# Altium project PCB_Project1.PrjPCB
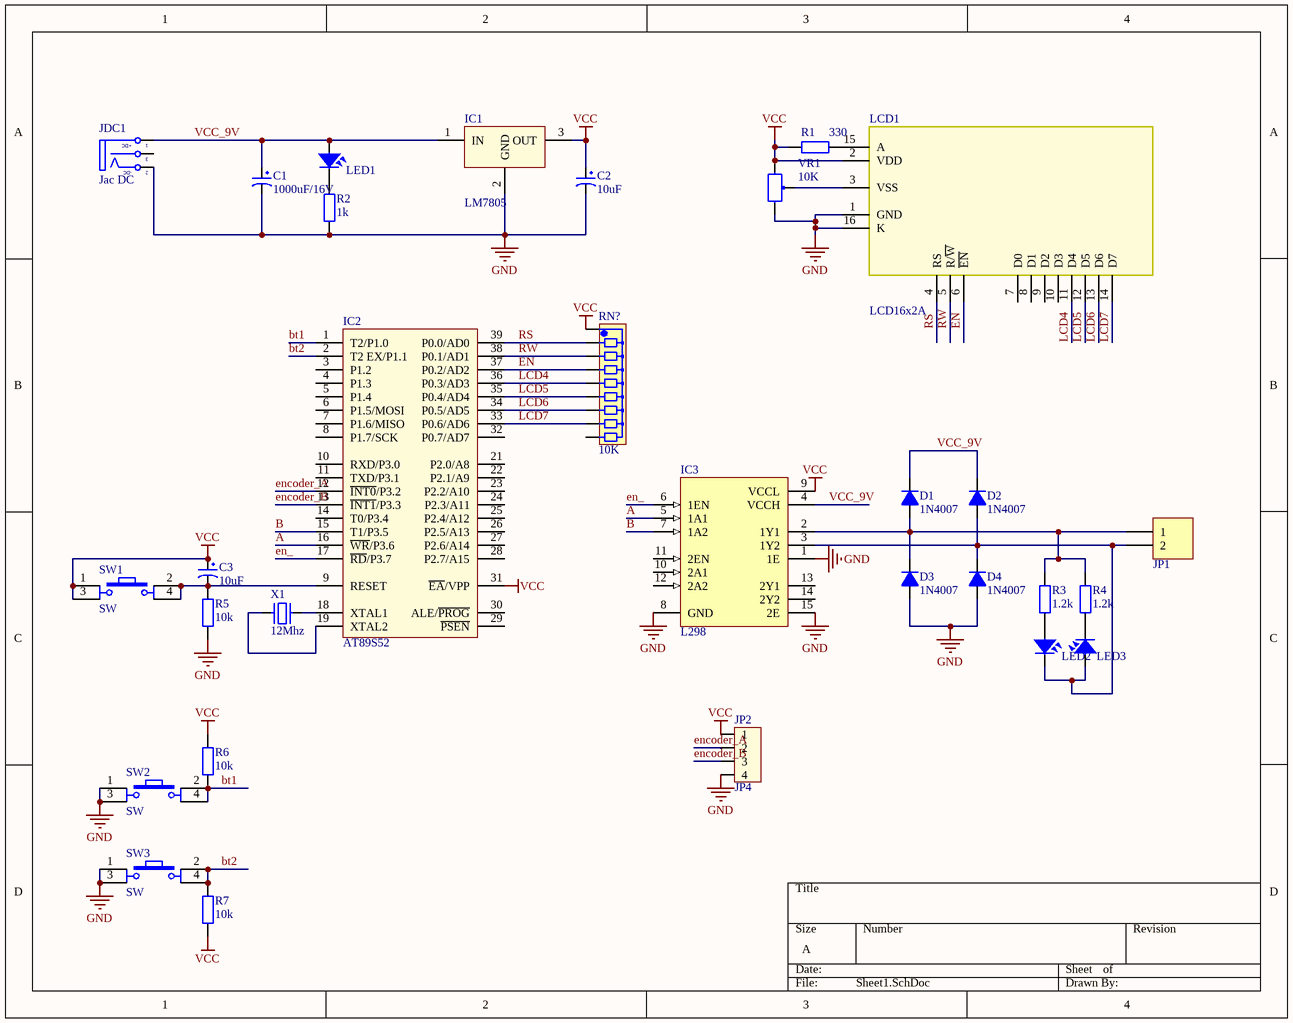
[diagram p0: Sheet1.SchDoc]
1 sheet, 30 parts. Net scope: global (net labels, ports and power ports of the same name join across sheets).
Board file: PCB1.PcbDoc

## Sheet Sheet1.SchDoc
size A

### Parts
C1  1000uF/16V  [CP1.5/3.4]
C2  10uF  [CP1/2]
C3  10uF  [CP1/2]
D1  1N4007  [D1A]
D2  1N4007  [D1A]
D3  1N4007  [D1A]
D4  1N4007  [D1A]
IC1  LM7805  [QTO-220]
IC2  AT89S52  [DIP40/W0.6]
IC3  L298  [DIP15SL2]
JDC1  Jac DC  [DC-IN]
JP1  Header 2_1  [HED2]  (value not drawn)
JP2  JP4  [CON4]
LCD1  LCD16x2A  [LCD16X2]
LED1  LED  [LED-3]  (value not drawn)
LED2  LED  [LED-3]  (value not drawn)
LED3  LED  [LED-3]  (value not drawn)
R1  330  [R1/4W]
R2  1k  [R1/4W]
R3  1.2k  [R1/4W]
R4  1.2k  [R1/4W]
R5  10k  [R1/4W]
R6  10k  [R1/4W]
R7  10k  [R1/4W]
RN?  10K  [RN8]
SW1  SW  [SW4]
SW2  SW  [SW4]
SW3  SW  [SW4]
VR1  10K  [VR]
X1  12Mhz  [XT2]

### Nets
GND: C1.2 C2.2 D3.1(A) D4.1(A) IC1.2(GND) IC2.20(GND) IC3.1(1E) IC3.8(GND) IC3.15(2E) JDC1.2(TN) JP2.4 LCD1.1(GND) LCD1.16(K) R2.1 R5.1 SW2.1 SW2.3 SW3.1 SW3.3 VR1.3
VCC: C2.1 C3.1 IC1.3(OUT) IC2.31(~{EA}/VPP) IC2.40(VCC) IC3.9(VCCL) JP2.1 LCD1.2(VDD) R1.2 R6.2 R7.1 RN?.1 SW1.1 SW1.3 VR1.1
A: IC2.16(~{WR}/P3.6) IC3.5(1A1)
B: IC2.15(T1/P3.5) IC3.7(1A2)
bt1: IC2.1(T2/P1.0) R6.1 SW2.2 SW2.4
bt2: IC2.2(T2_EX/P1.1) R7.2 SW3.2 SW3.4
EN: IC2.37(P0.2/AD2) LCD1.6(~{EN}) RN?.4
en_: IC2.17(~{RD}/P3.7) IC3.6(1EN)
encoder_A: IC2.12(~{INT0}/P3.2) JP2.2
encoder_B: IC2.13(~{INT1}/P3.3) JP2.3
LCD4: IC2.36(P0.3/AD3) LCD1.11(D4) RN?.5
LCD5: IC2.35(P0.4/AD4) LCD1.12(D5) RN?.6
LCD6: IC2.34(P0.5/AD5) LCD1.13(D6) RN?.7
LCD7: IC2.33(P0.6/AD6) LCD1.14(D7) RN?.8
RS: IC2.39(P0.0/AD0) LCD1.4(RS) RN?.2
RW: IC2.38(P0.1/AD1) LCD1.5(R/~{W}) RN?.3
VCC_9V: C1.1 D1.2(K) D2.2(K) IC1.1(IN) IC3.4(VCCH) JDC1.1(T) LED1.1
NetC3_2: C3.2 IC2.9(RESET) R5.2 SW1.2 SW1.4
NetD1_1: D1.1(A) D3.2(K) IC3.2(1Y1) JP1.1 R3.2 R4.2
NetD2_1: D2.1(A) D4.2(K) IC3.3(1Y2) JP1.2 LED2.2 LED3.1
NetIC2_18: IC2.18(XTAL1) X1.2
NetIC2_19: IC2.19(XTAL2) X1.1
NetLCD1_3: LCD1.3(VSS) VR1.2
NetLCD1_15: LCD1.15(A) R1.1
NetLED1_2: LED1.2 R2.2
NetLED2_1: LED2.1 R3.1
NetLED3_2: LED3.2 R4.1

Not connected (* = marked no-connect by the designer): IC2 3(P1.2) 4(P1.3) 5(P1.4) 6(P1.5/MOSI) 7(P1.6/MISO) 8(P1.7/SCK) 10(RXD/P3.0) 11(TXD/P3.1) 14(T0/P3.4) 21(P2.0/A8) 22(P2.1/A9) 23(P2.2/A10) 24(P2.3/A11) 25(P2.4/A12) 26(P2.5/A13) 27(P2.6/A14) 28(P2.7/A15) 29(~{PSEN}) 30(ALE/~{PROG}) 32(P0.7/AD7); IC3 10(2A1) 11(2EN) 12(2A2) 13(2Y1) 14(2Y2); JDC1 3(S); LCD1 7(D0) 8(D1) 9(D2) 10(D3); RN? 9

### Notes on the sheet
- (in symbol DCIN) +DC; -DC

### Library data of the parts
C1 = CP4: Cap 1000uF/16V - 220uF/50V; Description 5: 4,7uF>10uF/250V_3,3uF>10uF/400V - 2,2uF>4,7uF/450V; Description 1: 2200uF-3300uF/6,3V - 1000uF-2200uF/10V; Description 2: 1000uF/16V - 470uF => 1000uF/25V - 100uF/100V; Description 3: 330uF>470uF/35V_220uF>470uF/50V_10uF>22uF/250V; Description 4: 220uF => 330uF/63V - 10uF =>33uF/160 - 200V; Value: 1000uF/16V
C2 C3 = CP1: Cap P  0,1uF < 22uF , 16 - 50V; Value: 10uF/50V; Description 1: 10 => 220uF/6,3V/10V - 10uF => 100uF/16V; Description 2: 0,1uF => 33uF/50V - 10uF => 22uF/63V; Description 3: 0,47uF => 10uF/100V
D1-D4 = D1A: Diode 1A; Value: 1N4007
IC1 = LM78xx: On ap +, from + 5 to + 24VDC; Value: LM7805
IC2 = AT89S52: AT89S52, 8k Byte Flash Memory , 40 Pin; Value: AT89S52
IC3 = L298: Dual Full-H Driver; Note: The tab is elec is connected to GND pin; Published: 15-May-2002; DatasheetVersion: Jun-1990; PackageReference: KV015; Publisher: Altium Limited; PackageDescription: TO, Thru-Hole, Vertical, Heatsink Mounted; 15 Bent Staggered Leads; Pitch 1.27 mm; ComponentLink1Description: Manufacturer Link; ComponentLink1URL: http://www.ti.com/
JDC1 = DCIN: Jac DC input; Value: Jac DC
JP1 = Header 2_1: Header, 2-Pin; Manufacturer: Generic Components; Class: Connector; Value: Header 2
JP2 = Con4: Connector 4; Value: Connector 4
LCD1 = LCD16x2: LCD dipslay 16 char, 2 line; Value: LCD16x2A
LED1-LED3 = LED: LED Single colour Green and Red; Value: LED 3 ly Single Colour
R1-R7 = R1/4W: Resistor 1/4W; Value: R1/4W - 1K
RN? = RN8: Resistor 8 (Thanh); Value: Tro thanh 10K
SW1-SW3 = SW4: Switch button 4 pin; Value: Button chip 4 pin
VR1 = VR: Var Resistor; Value: VR 10K
X1 = XT2: Crystal For all Crystal 2pin.; Value: 4Mhz